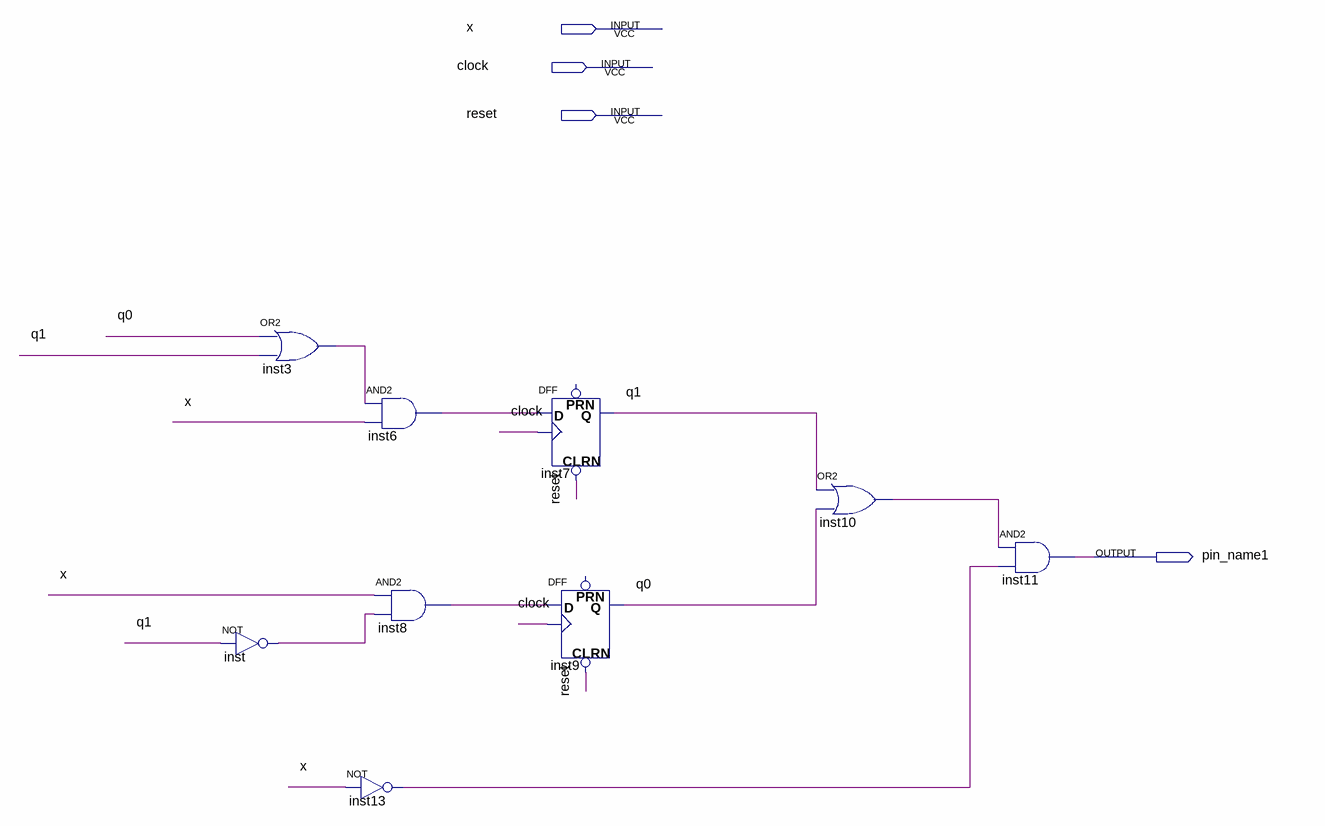
[diagram p0: schematic sheet]
// Quartus schematic testep_2.bdf as structural Verilog: 9 symbols, 4 pins
module testep_2 (
  input  x,
  input  clock,
  input  reset,
  output pin_name1
);

  wire inst3_out, inst6_out, inst8_out, inst10_out, inst13_out, inst_out, q0, q1;

  not inst (inst_out, q1);
  or inst3 (inst3_out, q0, q1);
  and inst6 (inst6_out, inst3_out, x);
  and inst8 (inst8_out, x, inst_out);
  not inst13 (inst13_out, x);
  DFF inst7 (.CLRN(reset), .CLK(clock), .D(inst6_out), .Q(q1));  // open: PRN
  DFF inst9 (.CLRN(reset), .CLK(clock), .D(inst8_out), .Q(q0));  // open: PRN
  or inst10 (inst10_out, q1, q0);
  and inst11 (pin_name1, inst10_out, inst13_out);
endmodule
